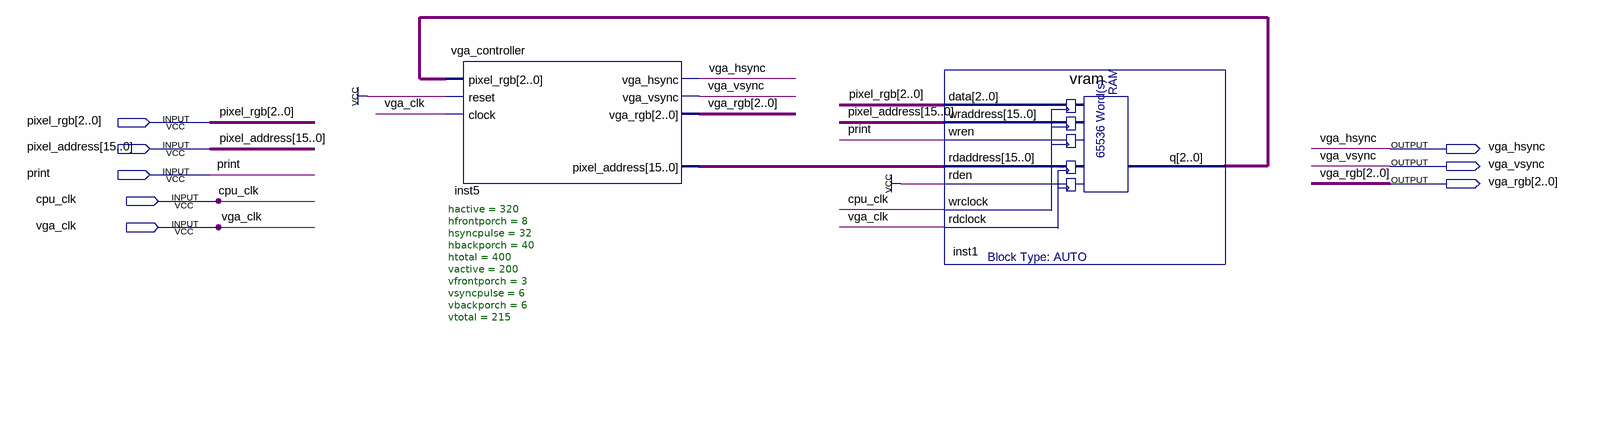
[diagram p0: schematic sheet]
// Quartus schematic vga_module.bdf as structural Verilog: 2 symbols, 8 pins
module vga_module (
  input  [2:0] pixel_rgb,
  input  [15:0] pixel_address,
  input  print,
  input  cpu_clk,
  input  vga_clk,
  output vga_hsync,
  output vga_vsync,
  output [2:0] vga_rgb
);

  wire [2:0] inst1_q;
  wire [15:0] inst5_pixel_address;

  vga_controller #(.hactive(320), .hfrontporch(8), .hsyncpulse(32), .hbackporch(40), .htotal(400), .vactive(200), .vfrontporch(3), .vsyncpulse(6), .vbackporch(6), .vtotal(215)) inst5 (
    .pixel_rgb(inst1_q), .reset(1'b1), .clock(vga_clk), .vga_hsync(vga_hsync), .vga_vsync(vga_vsync),
    .vga_rgb(vga_rgb), .pixel_address(inst5_pixel_address));
  vram inst1 (
    .data(pixel_rgb), .wraddress(pixel_address), .wren(print), .rdaddress(inst5_pixel_address), .rden(1'b1),
    .wrclock(cpu_clk), .rdclock(vga_clk), .q(inst1_q));
endmodule
